# Altium schematic sheet LCD_Schem.SchDoc
size A; SheetNumber: 6; SheetTotal: 6
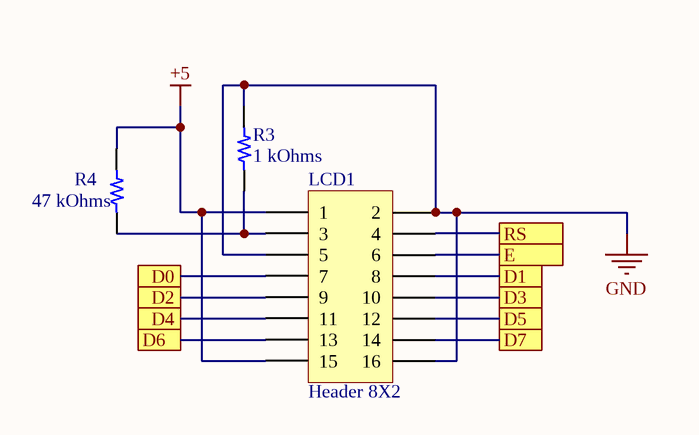
[diagram p0: LCD_Schem.SchDoc]

## Parts
LCD1  Header 8X2  [HDR2X8]
R3  1 kOhms  [RES 1210_3225]
R4  47 kOhms  [RES 1210_3225]

## Ports
D0, D1, D2, D3, D4, D5, D6, D7, E, RS

## Nets
+5: LCD1.1 LCD1.15 R4.2
GND: LCD1.2 LCD1.5 LCD1.16 R3.2
D0: LCD1.7 ; port D0
D1: LCD1.8 ; port D1
D2: LCD1.9 ; port D2
D3: LCD1.10 ; port D3
D4: LCD1.11 ; port D4
D5: LCD1.12 ; port D5
D6: LCD1.13 ; port D6
D7: LCD1.14 ; port D7
E: LCD1.6 ; port E
RS: LCD1.4 ; port RS
NetLCD1_3: LCD1.3 R3.1 R4.1

## Library data of the parts
LCD1 = Header 8X2: Header, 8-Pin, Dual row; LatestRevisionDate: 17-Jul-2002; LatestRevisionNote: Re-released for DXP Platform.; Publisher: Altium Limited
R3 = ESR25JZPJ102: RES SMD 1K OHM 5% 2/3W 1210; Manufacturer: Rohm Semiconductor; Power (Watts): 0.667W, 2/3W; Temperature Coefficient: ±200ppm/°C; Part Number: ESR25JZPJ102; ComponentLink1Description: Datasheet; ComponentLink1URL: https://www.rohm.com/datasheet/ESR01MZPF/esr-e; ComponentLink2Description: DigiKey Link; ComponentLink2URL: https://www.digikey.com/en/products/detail/rohm-semiconductor/ESR25JZPJ102/2288498; Composition: Thick Film; Device Package: 1210 (3225 Metric); Features: Automotive AEC-Q200, Pulse Withstanding; Height - Seated (Max): 0.026" (0.65mm); LastUpdated: 9/19/2022 2:02:25 PM; Lifecycle Status: Active; Minimum Order: 1; Number of Terminations: 2; Operating Temperature: -55°C ~ 155°C; Package / Case: 1210 (3225 Metric); Packaging: TapeAndReel; Part Status: Active; Price: 0.05; Ratings: AEC-Q200; Resistance: 1 kOhms; Series: ESR; Size / Dimension: 0.126" L x 0.098" W (3.20mm x 2.50mm); Supplier 1: DigiKey; Supplier Part Number 1: RHM1.0KAXCT-ND; Supplier Device Package: 1210; Tolerance: ±5%; Value: 1 kOhms
R4 = CRGP1210F47K: RES 47K OHM 1% 3/4W 1210; Manufacturer: TE Connectivity Passive Product; Power (Watts): 0.75W, 3/4W; Temperature Coefficient: ±100ppm/°C; Part Number: CRGP1210F47K; ComponentLink1Description: Datasheet; ComponentLink1URL: https://www.te.com/commerce/DocumentDelivery/DDEController?Action=srchrtrv&DocNm=9-1773463-9&DocType=DS&DocLang=English; ComponentLink2Description: DigiKey Link; ComponentLink2URL: https://www.digikey.com/en/products/detail/te-connectivity-passive-product/CRGP1210F47K/8577221; Composition: Thick Film; Device Package: 1210 (3225 Metric); Features: Pulse Withstanding; Height - Seated (Max): 0.026" (0.65mm); LastUpdated: 9/19/2022 2:02:30 PM; Lifecycle Status: Active; Minimum Order: 1; Number of Terminations: 2; Operating Temperature: -55°C ~ 155°C; Package / Case: 1210 (3225 Metric); Packaging: TapeAndReel; Part Status: Active; Price: 0.04; Resistance: 47 kOhms; Series: CRGP; Size / Dimension: 0.122" L x 0.102" W (3.10mm x 2.60mm); Supplier 1: DigiKey; Supplier Part Number 1: A130619CT-ND; Supplier Device Package: 1210; Tolerance: ±1%; Value: 47 kOhms